# Altium schematic sheet VFD25650.SchDoc
size A3
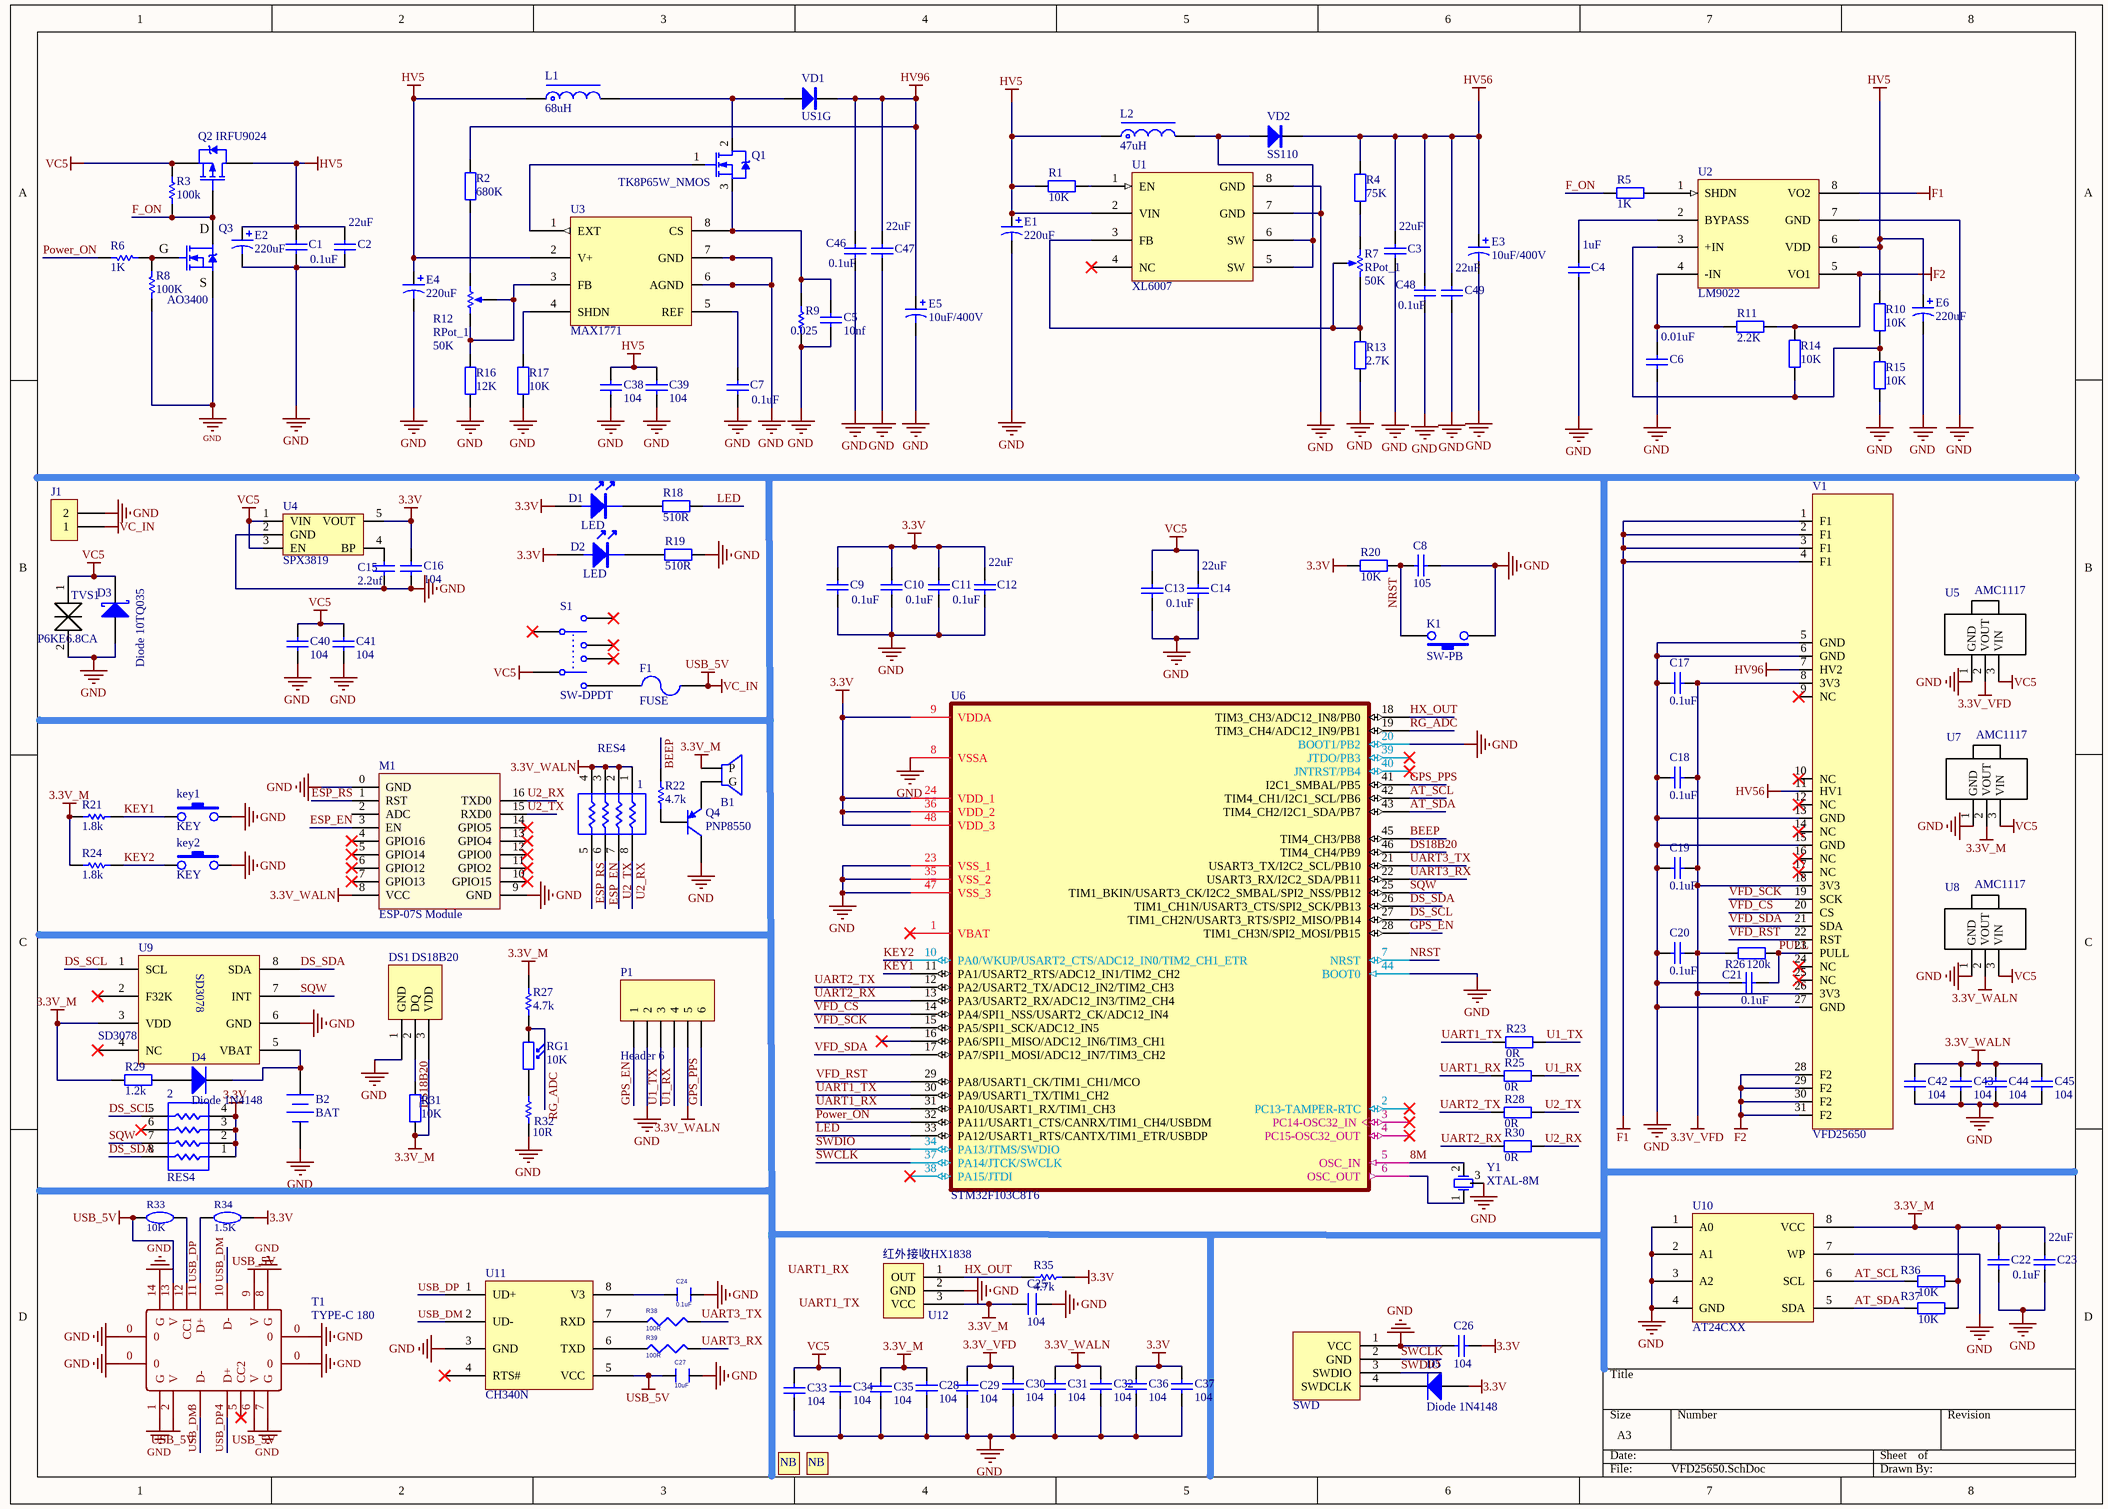
[diagram p0: VFD25650.SchDoc]

## Parts
1  RES4  [0603RES]
2  RES4  [0603RES]
B1  BEEP  [BELL-SMALL]  (value not drawn)
B2  BAT  [CR2032_B]
C1  value 0.1uF  [0603C]  (hidden comment: Cap)
C2  value 22uF  [0603C]  (hidden comment: Cap)
C3  value 22uF  [0603C]  (hidden comment: Cap)
C4  value 1uF  [0603C]  (hidden comment: Cap)
C5  10nf  [C 0603]
C6  value 0.01uF  [0603C]  (hidden comment: Cap)
C7  value 0.1uF  [0603C]  (hidden comment: Cap)
C8  105  [0603C]
C9  value 0.1uF  [0603C]  (hidden comment: Cap)
C10  value 0.1uF  [0603C]  (hidden comment: Cap)
C11  value 0.1uF  [0603C]  (hidden comment: Cap)
C12  value 22uF  [0603C]  (hidden comment: Cap)
C13  value 0.1uF  [0603C]  (hidden comment: Cap)
C14  value 22uF  [0603C]  (hidden comment: Cap)
C15  value 2.2uf  [0603C]  (hidden comment: Cap)
C16  value 104  [0603C]  (hidden comment: Cap)
C17  value 0.1uF  [0603C]  (hidden comment: Cap)
C18  value 0.1uF  [0603C]  (hidden comment: Cap)
C19  value 0.1uF  [0603C]  (hidden comment: Cap)
C20  value 0.1uF  [0603C]  (hidden comment: Cap)
C21  value 0.1uF  [0603C]  (hidden comment: Cap)
C22  value 0.1uF  [0603C]  (hidden comment: Cap)
C23  value 22uF  [0603C]  (hidden comment: Cap)
C24  0.1uF  [C 0603]
C25  104  [0603C]
C26  104  [0603C]
C27  10uF  [C 0603]
C28  value 104  [0603C]  (hidden comment: Cap)
C29  value 104  [0603C]  (hidden comment: Cap)
C30  value 104  [0603C]  (hidden comment: Cap)
C31  value 104  [0603C]  (hidden comment: Cap)
C32  value 104  [0603C]  (hidden comment: Cap)
C33  value 104  [0603C]  (hidden comment: Cap)
C34  value 104  [0603C]  (hidden comment: Cap)
C35  value 104  [0603C]  (hidden comment: Cap)
C36  value 104  [0603C]  (hidden comment: Cap)
C37  value 104  [0603C]  (hidden comment: Cap)
C38  value 104  [0603C]  (hidden comment: Cap)
C39  value 104  [0603C]  (hidden comment: Cap)
C40  value 104  [0603C]  (hidden comment: Cap)
C41  value 104  [0603C]  (hidden comment: Cap)
C42  value 104  [0603C]  (hidden comment: Cap)
C43  value 104  [0603C]  (hidden comment: Cap)
C44  value 104  [0603C]  (hidden comment: Cap)
C45  value 104  [0603C]  (hidden comment: Cap)
C46  value 0.1uF  [0805C]  (hidden comment: Cap)
C47  value 22uF  [0805C]  (hidden comment: Cap)
C48  value 0.1uF  [0805C]  (hidden comment: Cap)
C49  value 22uF  [0805C]  (hidden comment: Cap)
D1  LED  [LED 0805B]
D2  LED  [LED 0603R]
D3  Diode 10TQ035  [SOD-123]
D4  Diode 1N4148  [SOD-323]
D5  Diode 1N4148  [SOD-323]
DS1  DS18B20  [HDR-1X3]
E1  value 220uF  [CM D(6.3*5.4)]  (hidden comment: Cap Pol1)
E2  value 220uF  [CM D(6.3*5.4)]  (hidden comment: Cap Pol1)
E3  value 10uF/400V  [CM D(6.3*5.4)]  (hidden comment: Cap Pol1)
E4  value 220uF  [CM D(6.3*5.4)]  (hidden comment: Cap Pol1)
E5  value 10uF/400V  [CM D(6.3*5.4)]  (hidden comment: Cap Pol1)
E6  value 220uF  [CM D(6.3*5.4)]  (hidden comment: Cap Pol1)
F1  FUSE  [FU 0805]
J1  CON2  [DC-012]  (value not drawn)
K1  SW-PB  [KEY_M]
key1  KEY  [TSW DIP-6*6*7_V]
key2  KEY  [TSW DIP-6*6*7_V]
L1  68uH  [CDRH73]
L2  47uH  [CDRH73]
M1  ESP-07S Module  [ESP-07S Module]
P1  Header 6  [1.25-6p]
picture1  图标  [rapter]  (value not drawn)
picture2  图标  [LCL]  (value not drawn)
Q1  TK8P65W_NMOS  [TO252]
Q2  IRFU9024  [TO252 - duplicate]
Q3  AO3400  [MMBT3906]
Q4  PNP8550  [NPN8050 SOT23R]
R1  10K  [0805R]
R2  680K  [0805R]
R3  100k  [0805R]
R4  75K  [0805R]
R5  1K  [0805R]
R6  1K  [0603R]
R7  RPot_1  value 50K  [RPart]
R8  100K  [0603R]
R9  0.025  [RES 1206]
R10  10K  [0805R]
R11  2.2K  [0805R]
R12  RPot_1  value 50K  [RPart]
R13  2.7K  [0805R]
R14  10K  [0805R]
R15  10K  [0805R]
R16  12K  [0805R]
R17  10K  [0603R]
R18  510R  [0603R]
R19  510R  [0603R]
R20  10K  [0603R]
R21  1.8k  [0603R]
R22  4.7k  [0603R]
R23  0R  [0805R]
R24  1.8k  [0603R]
R25  0R  [0805R]
R26  120k  [R 0603]
R27  4.7k  [0603R]
R28  0R  [0805R]
R29  value 1.2k  [0603R]  (hidden comment: Res1)
R30  0R  [0805R]
R31  value 10K  [0603R]  (hidden comment: Res1)
R32  10R  [0603R]
R33  1A保险丝  [R 0603]  (value not drawn)
R34  1K  [R 0603]  (value not drawn)
R35  4.7k  [0603R]
R36  10K  [0603R]
R37  10K  [0603R]
R38  100R  [R 0603]
R39  100R  [R 0603]
RG1  10K  [RG5528]
S1  SW-DPDT  [SWitch - duplicate1]
SWD1  SWD  [1.25-4p]
T1  TYPE-C 180  [type-c 180]
TVS1  P6KE6.8CA  [SMB]
U1  XL6007  [SOP8_N]
U2  LM9022  [SOP8_N]
U3  MAX1771  [SOP8_N]
U4  SPX3819  [SOT23-5N]
U5  AMC1117  [AMS1117_SOT223]
U6  STM32F103C8T6  [LQFP48 7X7_L]
U7  AMC1117  [AMS1117_SOT223]
U8  AMC1117  [AMS1117_SOT223]
U9  SD3078  [SOP8W_L]
U10  AT24CXX  [SOP8_N]
U11  CH340N  [SOP8_N]
U12  红外接收HX1838  [红外HX1838]
V1  VFD25650  [VFD-25650]
VD1  US1G  [SMA]
VD2  SS110  [SMA]
Y1  XTAL-8M  [XTAL_8M]

## Nets
3.3V: 2.1 2.2 2.3 2.4 C9.2 C10.2 C11.2 C12.2 C16.2 C26.2 C36.2 C37.2 D1.1 D2.1 D5.1(A) R20.2 R34.1 R35.2 U4.5(VOUT) U6.9(VDDA) U6.24(VDD_1) U6.36(VDD_2) U6.48(VDD_3)
3.3V_M: B1.1(P) C22.2 C23.2 C25.2 C28.2 C35.2 DS1.3(VDD) R21.1 R24.1 R27.1 R29.1 R31.2 R36.1 R37.1 U7.2(VOUT) U9.3(VDD) U10.8(VCC) U12.3(VCC)
3.3V_VFD: C17.2 C18.1 C19.1 C20.1 C29.2 C30.2 R26.1 U5.2(VOUT) V1.8(3V3) V1.18(3V3) V1.26(3V3)
3.3V_WALN: 1.1 1.2 1.3 1.4 C31.2 C32.2 C42.2 C43.2 C44.2 C45.2 M1.8(VCC) P1.5 U8.2(VOUT)
F1: U2.8(VO2) V1.1(F1) V1.2(F1) V1.3(F1) V1.4(F1)
F2: R11.1 R14.2 U2.5(VO1) V1.28(F2) V1.29(F2) V1.30(F2) V1.31(F2)
GND: B2.2(-) C1.1 C2.1 C3.1 C4.1 C5.2 C6.1 C7.1 C8.1 C9.1 C10.1 C11.1 C12.1 C13.1 C14.1 C15.1 C16.1 C17.1 C18.2 C19.2 C20.2 C21.2 C22.1 C23.1 C24.1 C25.1 C26.1 C27.2 C28.1 C29.1 C30.1 C31.1 C32.1 C33.1 C34.1 C35.1 C36.1 C37.1 C38.1 C39.1 C40.1 C41.1 C42.1 C43.1 C44.1 C45.1 C46.1 C47.1 C48.1 C49.1 D3.1(A) DS1.1(GND) E1.2 E2.2 E3.2 E4.2 E5.2 E6.2 J1.2 K1.1 key1.2 key2.2 M1.0(GND) M1.9(GND) P1.2 Q3.2(D) Q4.3(C) R8.2 R9.1 R13.1 R15.2 R16.1 R17.2 R19.2 R32.2 SWD1.1(VCC) T1.0 T1.1(G) T1.7(G) T1.8(G) T1.14(G) TVS1.2 U1.7(GND) U1.8(GND) U2.7(GND) U3.6(AGND) U3.7(GND) U4.2(GND) U5.1(GND) U6.8(VSSA) U6.20(BOOT1/PB2) U6.23(VSS_1) U6.35(VSS_2) U6.44(BOOT0) U6.47(VSS_3) U7.1(GND) U8.1(GND) U9.6(GND) U10.1(A0) U10.2(A1) U10.3(A2) U10.4(GND) U10.7(WP) U11.3(GND) U12.2(GND) V1.5(GND) V1.6(GND) V1.13(GND) V1.15(GND) V1.27(GND) Y1.3
HV5: C1.2 C2.2 C38.2 C39.2 E1.1 E2.1 E4.1 E6.1 L1.1 L2.1 Q2.2(D) R1.2 R10.2 U1.2(VIN) U2.6(VDD) U3.2(V+)
HV56: C3.2 C48.2 C49.2 E3.1 R4.2 V1.11(HV1) VD2.2(K)
HV96: C46.2 C47.2 E5.1 R2.2 V1.7(HV2) VD1.2(K)
USB_5V: C27.1 F1.2 J1.1 R33.2 T1.2(V) T1.6(V) T1.9(V) T1.13(V) U11.5(VCC)  [also labelled VC_IN]
VC5: C13.2 C14.2 C33.2 C34.2 C40.2 C41.2 D3.2(K) Q2.3(S) R3.2 S1.2 TVS1.1 U4.1(VIN) U4.3(EN) U5.3(VIN) U7.3(VIN) U8.3(VIN)
8M: U6.5(OSC_IN) Y1.2(OSC2)
AT_SCL: R36.2 U6.42(TIM4_CH1/I2C1_SCL/PB6) U10.6(SCL)
AT_SDA: R37.2 U6.43(TIM4_CH2/I2C1_SDA/PB7) U10.5(SDA)
BEEP: R22.2 U6.45(TIM4_CH3/PB8)
DS18B20: DS1.2(DQ) R31.1 U6.46(TIM4_CH4/PB9)
DS_SCL: 2.5 U6.27(TIM1_CH2N/USART3_RTS/SPI2_MISO/PB14) U9.1(SCL)
DS_SDA: 2.8 U6.26(TIM1_CH1N/USART3_CTS/SPI2_SCK/PB13) U9.8(SDA)
ESP_EN: 1.6 M1.3(EN)
ESP_RS: 1.5 M1.1(RST)
F_ON: Q2.1(G) Q3.3(S) R3.1 R5.2
GPS_EN: P1.1 U6.28(TIM1_CH3N/SPI2_MOSI/PB15)
GPS_PPS: P1.6 U6.41(I2C1_SMBAL/PB5)
HX_OUT: R35.1 U6.18(TIM3_CH3/ADC12_IN8/PB0) U12.1(OUT)
KEY1: key1.1 R21.2 U6.11(PA1/USART2_RTS/ADC12_IN1/TIM2_CH2)
KEY2: key2.1 R24.2 U6.10(PA0/WKUP/USART2_CTS/ADC12_IN0/TIM2_CH1_ETR)
LED: R18.2 U6.33(PA12/USART1_RTS/CANTX/TIM1_ETR/USBDP)
NRST: C8.2 K1.2 R20.1 U6.7(NRST)
Power_ON: R6.2 U6.32(PA11/USART1_CTS/CANRX/TIM1_CH4/USBDM)
PULL: C21.1 R26.2 V1.23(PULL)
RG_ADC: R27.2 RG1.1 U6.19(TIM3_CH4/ADC12_IN9/PB1)
SQW: 2.7 U6.25(TIM1_BKIN/USART3_CK/I2C2_SMBAL/SPI2_NSS/PB12) U9.7(INT)
SWCLK: SWD1.2(GND) U6.37(PA14/JTCK/SWCLK)
SWDIO: SWD1.3(SWDIO) U6.34(PA13/JTMS/SWDIO)
U1_RX: P1.4 R25.2
U1_TX: P1.3 R23.2
U2_RX: 1.8 M1.16(TXD0) R30.2
U2_TX: 1.7 M1.15(RXD0) R28.2
UART1_RX: R25.1 U6.31(PA10/USART1_RX/TIM1_CH3)
UART1_TX: R23.1 U6.30(PA9/USART1_TX/TIM1_CH2)
UART2_RX: R30.1 U6.13(PA3/USART2_RX/ADC12_IN3/TIM2_CH4)
UART2_TX: R28.1 U6.12(PA2/USART2_TX/ADC12_IN2/TIM2_CH3)
UART3_RX: R39.2 U6.22(USART3_RX/I2C2_SDA/PB11)
UART3_TX: R38.2 U6.21(USART3_TX/I2C2_SCL/PB10)
USB_DM: T1.3(D-) T1.10(D-) U11.2(UD-)
USB_DP: R34.2 T1.4(D+) T1.11(D+) U11.1(UD+)
VFD_CS: U6.14(PA4/SPI1_NSS/USART2_CK/ADC12_IN4) V1.20(CS)
VFD_RST: U6.29(PA8/USART1_CK/TIM1_CH1/MCO) V1.22(RST)
VFD_SCK: U6.15(PA5/SPI1_SCK/ADC12_IN5) V1.19(SCK)
VFD_SDA: U6.17(PA7/SPI1_MOSI/ADC12_IN7/TIM3_CH2) V1.21(SDA)
NetB1_2: B1.2(G) Q4.2(E)
NetB2_1: B2.1(+) D4.2(K) U9.5(VBAT)
NetC4_2: C4.2 U2.2(BYPASS)
NetC5_1: C5.1 Q1.3(S) R9.2 U3.8(CS)
NetC6_2: C6.2 R11.2 U2.4(-IN)
NetC7_2: C7.2 U3.5(REF)
NetC15_2: C15.2 U4.4(BP)
NetC24_2: C24.2 U11.8(V3)
NetD1_2: D1.2 R18.1
NetD2_2: D2.2 R19.1
NetD4_1: D4.1(A) R29.2
NetD5_2: D5.2(K) SWD1.4(SWDCLK)
NetF1_1: F1.1 S1.1
NetL1_2: L1.2 Q1.2(D) VD1.1(A)
NetL2_2: L2.2 U1.5(SW) U1.6(SW) VD2.1(A)
NetQ1_1: Q1.1(G) U3.1(EXT)
NetQ3_1: Q3.1(G) R6.1 R8.1
NetQ4_1: Q4.1(B) R22.1
NetR1_1: R1.1 U1.1(EN)
NetR2_1: R2.1 R12.3(BOT)
NetR4_1: R4.1 R7.3(BOT)
NetR5_1: R5.1 U2.1(SHDN)
NetR7_1: R7.1(TOP) R7.2(TAP) R13.2 U1.3(FB)
NetR10_1: R10.1 R14.1 R15.1 U2.3(+IN)
NetR12_1: R12.1(TOP) R12.2(TAP) R16.2 U3.3(FB)
NetR17_1: R17.1 U3.4(SHDN)
NetR32_1: R32.1 RG1.2
NetR33_1: R33.1 T1.12(CC1)
NetR38_1: R38.1 U11.7(RXD)
NetR39_1: R39.1 U11.6(TXD)
NetU6_6: U6.6(OSC_OUT) Y1.1(OSC1)

Not connected (* = marked no-connect by the designer): 2 6*; M1 2(ADC) 4(GPIO16)* 5(GPIO14)* 6(GPIO12)* 7(GPIO13)* 10(GPIO15)* 11(GPIO2)* 12(GPIO0)* 13(GPIO4)* 14(GPIO5)*; S1 3* 4(5)* 5(4)*; T1 5(CC2)*; U1 4(NC)*; U6 1(VBAT)* 2(PC13-TAMPER-RTC)* 3(PC14-OSC32_IN)* 4(PC15-OSC32_OUT)* 16(PA6/SPI1_MISO/ADC12_IN6/TIM3_CH1)* 38(PA15/JTDI)* 39(JTDO/PB3)* 40(JNTRST/PB4)*; U9 2(F32K)* 4(NC)*; U11 4(RTS#)*; V1 9(NC)* 10(NC)* 12(NC)* 14(NC)* 16(NC)* 17(NC)* 24(NC)* 25(NC)*

## Notes on the sheet
- Labels drawn without touching a wire or pin: UART1_RX, UART1_TX
- (in symbol SP) NB

## Library data of the parts
C1-C4 C6 C7 C9-C14 C17-C23 C26 C46-C49 = Cap: Capacitor; Published: 8-Jun-2000; LatestRevisionDate: 17-Jul-2002; LatestRevisionNote: Re-released for DXP Platform.; Publisher: Altium Limited
  C1-C4 C6 C7 C9-C14 C17-C23 C46-C49: PackageReference: RAD-0.3
  C26: Value: 104
C5 = Cap: 贴片电容; Published: 8-Jun-2000; LatestRevisionDate: 17-Jul-2002; LatestRevisionNote: Re-released for DXP Platform.; PackageReference: RAD-0.3; Publisher: Altium Limited; PackageDescription: Radial Cap, Thru-Hole; 2 Leads; 0.3 in Pin Spacing
C8 = Cap: Capacitor; Value: 104; Published: 8-Jun-2000; LatestRevisionDate: 17-Jul-2002; LatestRevisionNote: Re-released for DXP Platform.; Publisher: Altium Limited
C15 C16 = Cap: Polarized Capacitor (Radial); Published: 8-Jun-2000; Revision: July-2002: Re-released for DXP Platform.; Publisher: Altium Limited
C24 = CAPACITOR: CAP ±20%/6.3V/X5R/SMT0402
C25 = 0603C
C27 = CAPACITOR: CAP ±20%/10V/X5R/SMT0603
C28-C45 = Cap: 无极性电容; Published: 8-Jun-2000; LatestRevisionDate: 17-Jul-2002; LatestRevisionNote: Re-released for DXP Platform.; PackageReference: RAD-0.3; Publisher: Altium Limited
D3 = Diode 10TQ035: Schottky Rectifier; Note: Terminal 2 is the TAB and is electrically connected to the cathode; Published: 8-Jun-2000; LatestRevisionDate: 17-Jul-2002; LatestRevisionNote: Re-released for DXP Platform.; DatasheetVersion: PD-2.057B; PackageVersion: Feb-1998; PackageReference: TO-220AC; Publisher: Altium Limited; PackageDescription: TO, Thru-Hole, Vertical, Heatsink Mounted; 3 In-Line Leads (1 Absent); Pitch 2.54 mm; ComponentLink1Description: Manufacturer Link; ComponentLink1URL: http://www.irf.com/; ComponentLink2Description: Datasheet; ComponentLink2URL: http://www.irf.com/product-info/datasheets/data/10tq.pdf
D4 D5 = Diode 1N4148: High Conductance Fast Diode; Published: 8-Jun-2000; LatestRevisionDate: 17-Jul-2002; LatestRevisionNote: Re-released for DXP Platform.; DatasheetVersion: 1997; PackageReference: DO-35; Publisher: Altium Limited; PackageDescription: Diode, Axial; Body 3.8 x 1.9 mm (LxDia. max), Lead Dia. 0.53 mm (max); Code_JEDEC: DO-204-AH; ComponentLink1Description: Manufacturer Link; ComponentLink1URL: http://www.fairchildsemi.com/; ComponentLink2Description: Datasheet; ComponentLink2URL: http://www.fairchildsemi.com/ds/1N%2F1N4148.pdf
DS1 = DS18B20: 温度传感器
E1-E6 = Cap Pol1: Polarized Capacitor (Radial); Published: 8-Jun-2000; LatestRevisionDate: 17-Jul-2002; LatestRevisionNote: Re-released for DXP Platform.; PackageReference: RB7.6-15; Publisher: Altium Limited; PackageDescription: Polarized Capacitor (Radial); 2 Leads
J1 = CON2: Connector
L1 L2 = L-PK: 工字电感; 版权归属: 源创客; BOM名称: 工字电感; 学习资源: www.ooocke.com
P1 = Header 6: Header, 6-Pin; LatestRevisionDate: 17-Jul-2002; LatestRevisionNote: Re-released for DXP Platform.; Publisher: Altium Limited
picture1 picture2 = SP
Q1 = IR7843_NMOS
Q2 = PMOS-2: P-Channel Power MOSFET; Note: Pin 4 not drawn and electrically connected to Pin 2.; Published: 8-Jun-2000; LatestRevisionDate: 17-Jul-2002; LatestRevisionNote: Re-released for DXP Platform.; DatasheetVersion: PD-9.390D; PackageVersion: Feb-1997; PackageReference: TO-220AB; Publisher: Altium Limited; PackageDescription: TO, Thru-Hole, Vertical, Heatsink Mounted; 3 In-Line Leads; Pitch 2.54 mm; ComponentLink1Description: Manufacturer Link; ComponentLink1URL: http://www.irf.com/
Q3 = 2SK3615: N沟场效应管 贴片SOT23-3; 版权归属: 源创客; BOM名称: N沟场效应管; 学习资源: www.ooocke.com
R1 R2 R4 R5 R10 R11 R13-R20 R23 R25 R26 R28 R30 R36 R37 = Res2: Resistor; Published: 8-Jun-2000; LatestRevisionDate: 17-Jul-2002; LatestRevisionNote: Re-released for DXP Platform.; Publisher: Altium Limited
R3 R21 R22 R24 R27 R32 R35 = 0603r
R6 = Res1: 贴片电阻 0603; Published: 8-Jun-2000; LatestRevisionDate: 17-Jul-2002; LatestRevisionNote: Re-released for DXP Platform.; PackageReference: AXIAL-0.3; Publisher: Altium Limited; PackageDescription: Axial Device, Thru-Hole; 2 Leads; 0.3 in Pin Spacing; Value: 1K
R7 R12 = RPot_1: Potentiometer; Sim Note: Enter the Resistance value and the set point into parameter fields.; Set Position: 0.5; Published: 8-Jun-2000; LatestRevisionDate: 17-Jul-2002; LatestRevisionNote: Re-released for DXP Platform.; PackageReference: VR5; Publisher: Altium Limited; PackageDescription: Variable Resistor, Thru-Hole; 3 Leads
R8 = Res1: 贴片电阻 0603; Value: 1K; Published: 8-Jun-2000; LatestRevisionDate: 17-Jul-2002; LatestRevisionNote: Re-released for DXP Platform.; PackageReference: AXIAL-0.3; Publisher: Altium Limited; PackageDescription: Axial Device, Thru-Hole; 2 Leads; 0.3 in Pin Spacing
R9 R29 R31 = Res1: 贴片电阻; Published: 8-Jun-2000; LatestRevisionDate: 17-Jul-2002; LatestRevisionNote: Re-released for DXP Platform.; Publisher: Altium Limited
  R9: PackageReference: AXIAL-0.3; PackageDescription: Axial Device, Thru-Hole; 2 Leads; 0.3 in Pin Spacing
  R29 R31: PackageReference: AXIAL-0.4
R33 = 10K: Published: 8-Jun-2000; LatestRevisionDate: 17-Jul-2002; LatestRevisionNote: Re-released for DXP Platform.; PackageReference: AXIAL-0.4; Publisher: Altium Limited; Comment_1: 10K
R34 = 1.5K: Published: 8-Jun-2000; LatestRevisionDate: 17-Jul-2002; LatestRevisionNote: Re-released for DXP Platform.; PackageReference: AXIAL-0.4; Publisher: Altium Limited; Comment_1: 1.5K
R38 R39 = R_Dup1: RES 1/16W 5% SMT0402
RG1 = RG5528: 光敏电阻; 版权归属: 源创客; BOM名称: 光敏电阻; 学习资源: www.ooocke.com
S1 = SW-DPDT: Double-Pole, Double-Throw Switch; Published: 24-Mar-1999; LatestRevisionDate: 17-Jul-2002; LatestRevisionNote: Re-released for DXP Platform.; PackageReference: DPDT-6; Publisher: Altium Limited; PackageDescription: Switch; 6 Leads
U4 = RT9193-33: 3.3V超低压差LDO
U6 = STM32F103C8T6: STM32 ARM-based 32-bit MCU with 64 Kbytes Flash, 48-pin LQFP, Industrial Temperature; Published: *; DatasheetVersion: *; PackageVersion: *; PackageReference: *; Publisher: *; PackageDescription: *; ComponentLink1Description: *; ComponentLink1URL: *; ComponentLink2Description: *; ComponentLink2URL: *
VD1 VD2 = SS14: 肖特基二极管; 版权归属: 源创客; 属性: 40V/1A; BOM名称: 肖特基二极管; 学习资源: www.ooocke.com